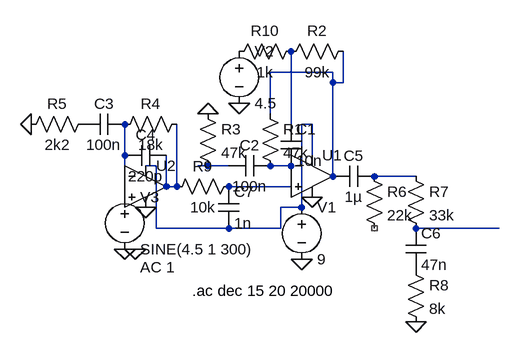
[diagram p0: schematic OCD.asc]
OCD.asc, the LTspice schematic file:
Version 4
SHEET 1 880 680
WIRE 128 32 32 32
WIRE 128 48 128 32
WIRE 144 48 144 0
WIRE 144 48 128 48
WIRE 32 96 32 32
WIRE 64 112 64 0
WIRE 96 112 80 112
WIRE -192 160 -192 112
WIRE 96 160 96 112
WIRE -144 176 -160 176
WIRE -64 176 -80 176
WIRE -32 176 -64 176
WIRE 64 176 32 176
WIRE -192 192 -192 160
WIRE 128 192 128 48
WIRE 192 192 176 192
WIRE 256 192 192 192
WIRE -128 208 -128 160
WIRE -112 208 -112 112
WIRE -112 208 -128 208
WIRE 64 208 -32 208
WIRE 80 240 80 112
WIRE 80 240 48 240
WIRE -144 272 -144 176
WIRE -32 272 -144 272
WIRE 48 272 48 240
WIRE 48 272 -32 272
WIRE 384 272 256 272
FLAG 96 224 0
FLAG 80 320 0
FLAG -64 96 0
FLAG -160 240 0
FLAG -176 304 0
FLAG -336 112 0
FLAG -192 304 0
FLAG 256 416 0
FLAG -16 80 0
SYMBOL voltage 80 224 R0
WINDOW 123 0 0 Left 0
WINDOW 39 0 0 Left 0
SYMATTR InstName V1
SYMATTR Value 9
SYMBOL Opamps\\UniversalOpamp2 96 192 R0
SYMATTR InstName U1
SYMBOL cap 48 112 R0
SYMATTR InstName C1
SYMATTR Value 10n
SYMBOL res 16 80 R0
SYMATTR InstName R1
SYMATTR Value 47k
SYMBOL res -80 80 R0
SYMATTR InstName R3
SYMATTR Value 47k
SYMBOL cap 32 160 R90
WINDOW 0 0 32 VBottom 2
WINDOW 3 32 32 VTop 2
SYMATTR InstName C2
SYMATTR Value 100n
SYMBOL Opamps\\UniversalOpamp2 -160 208 R0
SYMATTR InstName U2
SYMBOL voltage -192 208 R0
WINDOW 123 24 124 Left 2
WINDOW 39 0 0 Left 0
SYMATTR Value2 AC 1
SYMATTR InstName V3
SYMATTR Value SINE(4.5 1 300)
SYMBOL cap -192 96 R90
WINDOW 0 0 32 VBottom 2
WINDOW 3 32 32 VTop 2
SYMATTR InstName C3
SYMATTR Value 100n
SYMBOL cap -128 144 R90
WINDOW 0 0 32 VBottom 2
WINDOW 3 32 32 VTop 2
SYMATTR InstName C4
SYMATTR Value 220p
SYMBOL res -96 96 R90
WINDOW 0 0 56 VBottom 2
WINDOW 3 32 56 VTop 2
SYMATTR InstName R4
SYMATTR Value 18k
SYMBOL res -240 96 R90
WINDOW 0 0 56 VBottom 2
WINDOW 3 32 56 VTop 2
SYMATTR InstName R5
SYMATTR Value 2k2
SYMBOL cap 192 176 R90
WINDOW 0 0 32 VBottom 2
WINDOW 3 32 32 VTop 2
SYMATTR InstName C5
SYMATTR Value 1µ
SYMBOL res 176 176 R0
SYMATTR InstName R6
SYMATTR Value 22k
SYMBOL res 240 176 R0
SYMATTR InstName R7
SYMATTR Value 33k
SYMBOL cap 240 272 R0
SYMATTR InstName C6
SYMATTR Value 47n
SYMBOL res 240 320 R0
SYMATTR InstName R8
SYMATTR Value 8k
SYMBOL res -16 192 R90
WINDOW 0 0 56 VBottom 2
WINDOW 3 32 56 VTop 2
SYMATTR InstName R9
SYMATTR Value 10k
SYMBOL cap -48 208 R0
SYMATTR InstName C7
SYMATTR Value 1n
SYMBOL res 160 -16 R90
WINDOW 0 0 56 VBottom 2
WINDOW 3 32 56 VTop 2
SYMATTR InstName R2
SYMATTR Value 99k
SYMBOL res 80 -16 R90
WINDOW 0 0 56 VBottom 2
WINDOW 3 32 56 VTop 2
SYMATTR InstName R10
SYMATTR Value 1k
SYMBOL voltage -16 -16 R0
WINDOW 123 0 0 Left 0
WINDOW 39 0 0 Left 0
SYMATTR InstName V2
SYMATTR Value 4.5
TEXT -88 368 Left 2 !.ac dec 15 20 20000

The netlist it stands for:
* OCD.asc
V1 N003 0 9
XU1 N009 N006 N003 0 N001 level.2 Avol=1Meg GBW=10Meg Slew=10Meg ilimit=25m rail=0 Vos=0 phimargin=45 en=0 enk=0 in=0 ink=0 Rin=500Meg  ; pins IN+ IN- V+ V- OUT
C1 N002 N006 10n
R1 N001 N006 47k
R3 0 N005 47k
C2 N006 N005 100n
XU2 P001 N004 N003 0 N008 level.2 Avol=1Meg GBW=10Meg Slew=10Meg ilimit=25m rail=0 Vos=0 phimargin=45 en=0 enk=0 in=0 ink=0 Rin=500Meg  ; pins IN+ IN- V+ V- OUT
V3 P001 0 SINE(4.5 1 300) AC 1
C3 N004 P002 100n
C4 N008 N004 220p
R4 N008 N004 18k
R5 P002 0 2k2
C5 N007 N001 1µ
R6 N007 NC_01 22k
R7 N007 N010 33k
C6 N010 P003 47n
R8 P003 0 8k
R9 N009 N008 10k
C7 N009 N003 1n
R2 N001 N002 99k
R10 N002 P004 1k
V2 P004 0 4.5
.ac dec 15 20 20000
.lib UniversalOpamps2.sub
.backanno
.end